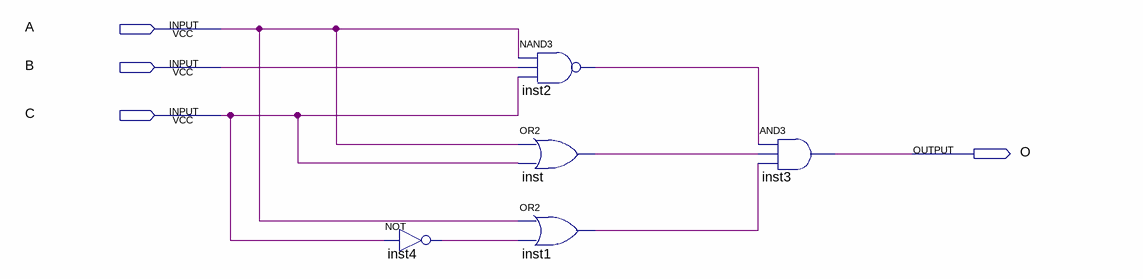
[diagram p0: schematic sheet]
// Quartus schematic truthtable.bdf as structural Verilog: 5 symbols, 4 pins
module truthtable (
  input  A,
  input  B,
  input  C,
  output O
);

  wire inst1_out, inst2_out, inst4_out, inst_out;

  not inst4 (inst4_out, C);
  nand inst2 (inst2_out, A, B, C);
  or inst (inst_out, A, C);
  or inst1 (inst1_out, A, inst4_out);
  and inst3 (O, inst2_out, inst_out, inst1_out);
endmodule
